# EasyEDA Pro project SplitUSB.epro

# Schematic Schematic1
Board Name: Board1; Create Date: 2026-05-01; Page Name: P1; Project Name: SplitUSB; Schematic Name: Schematic1; Update Date: 2026-05-01; Company: EasyEDA.com; Page Size: A4; Version: V1.0
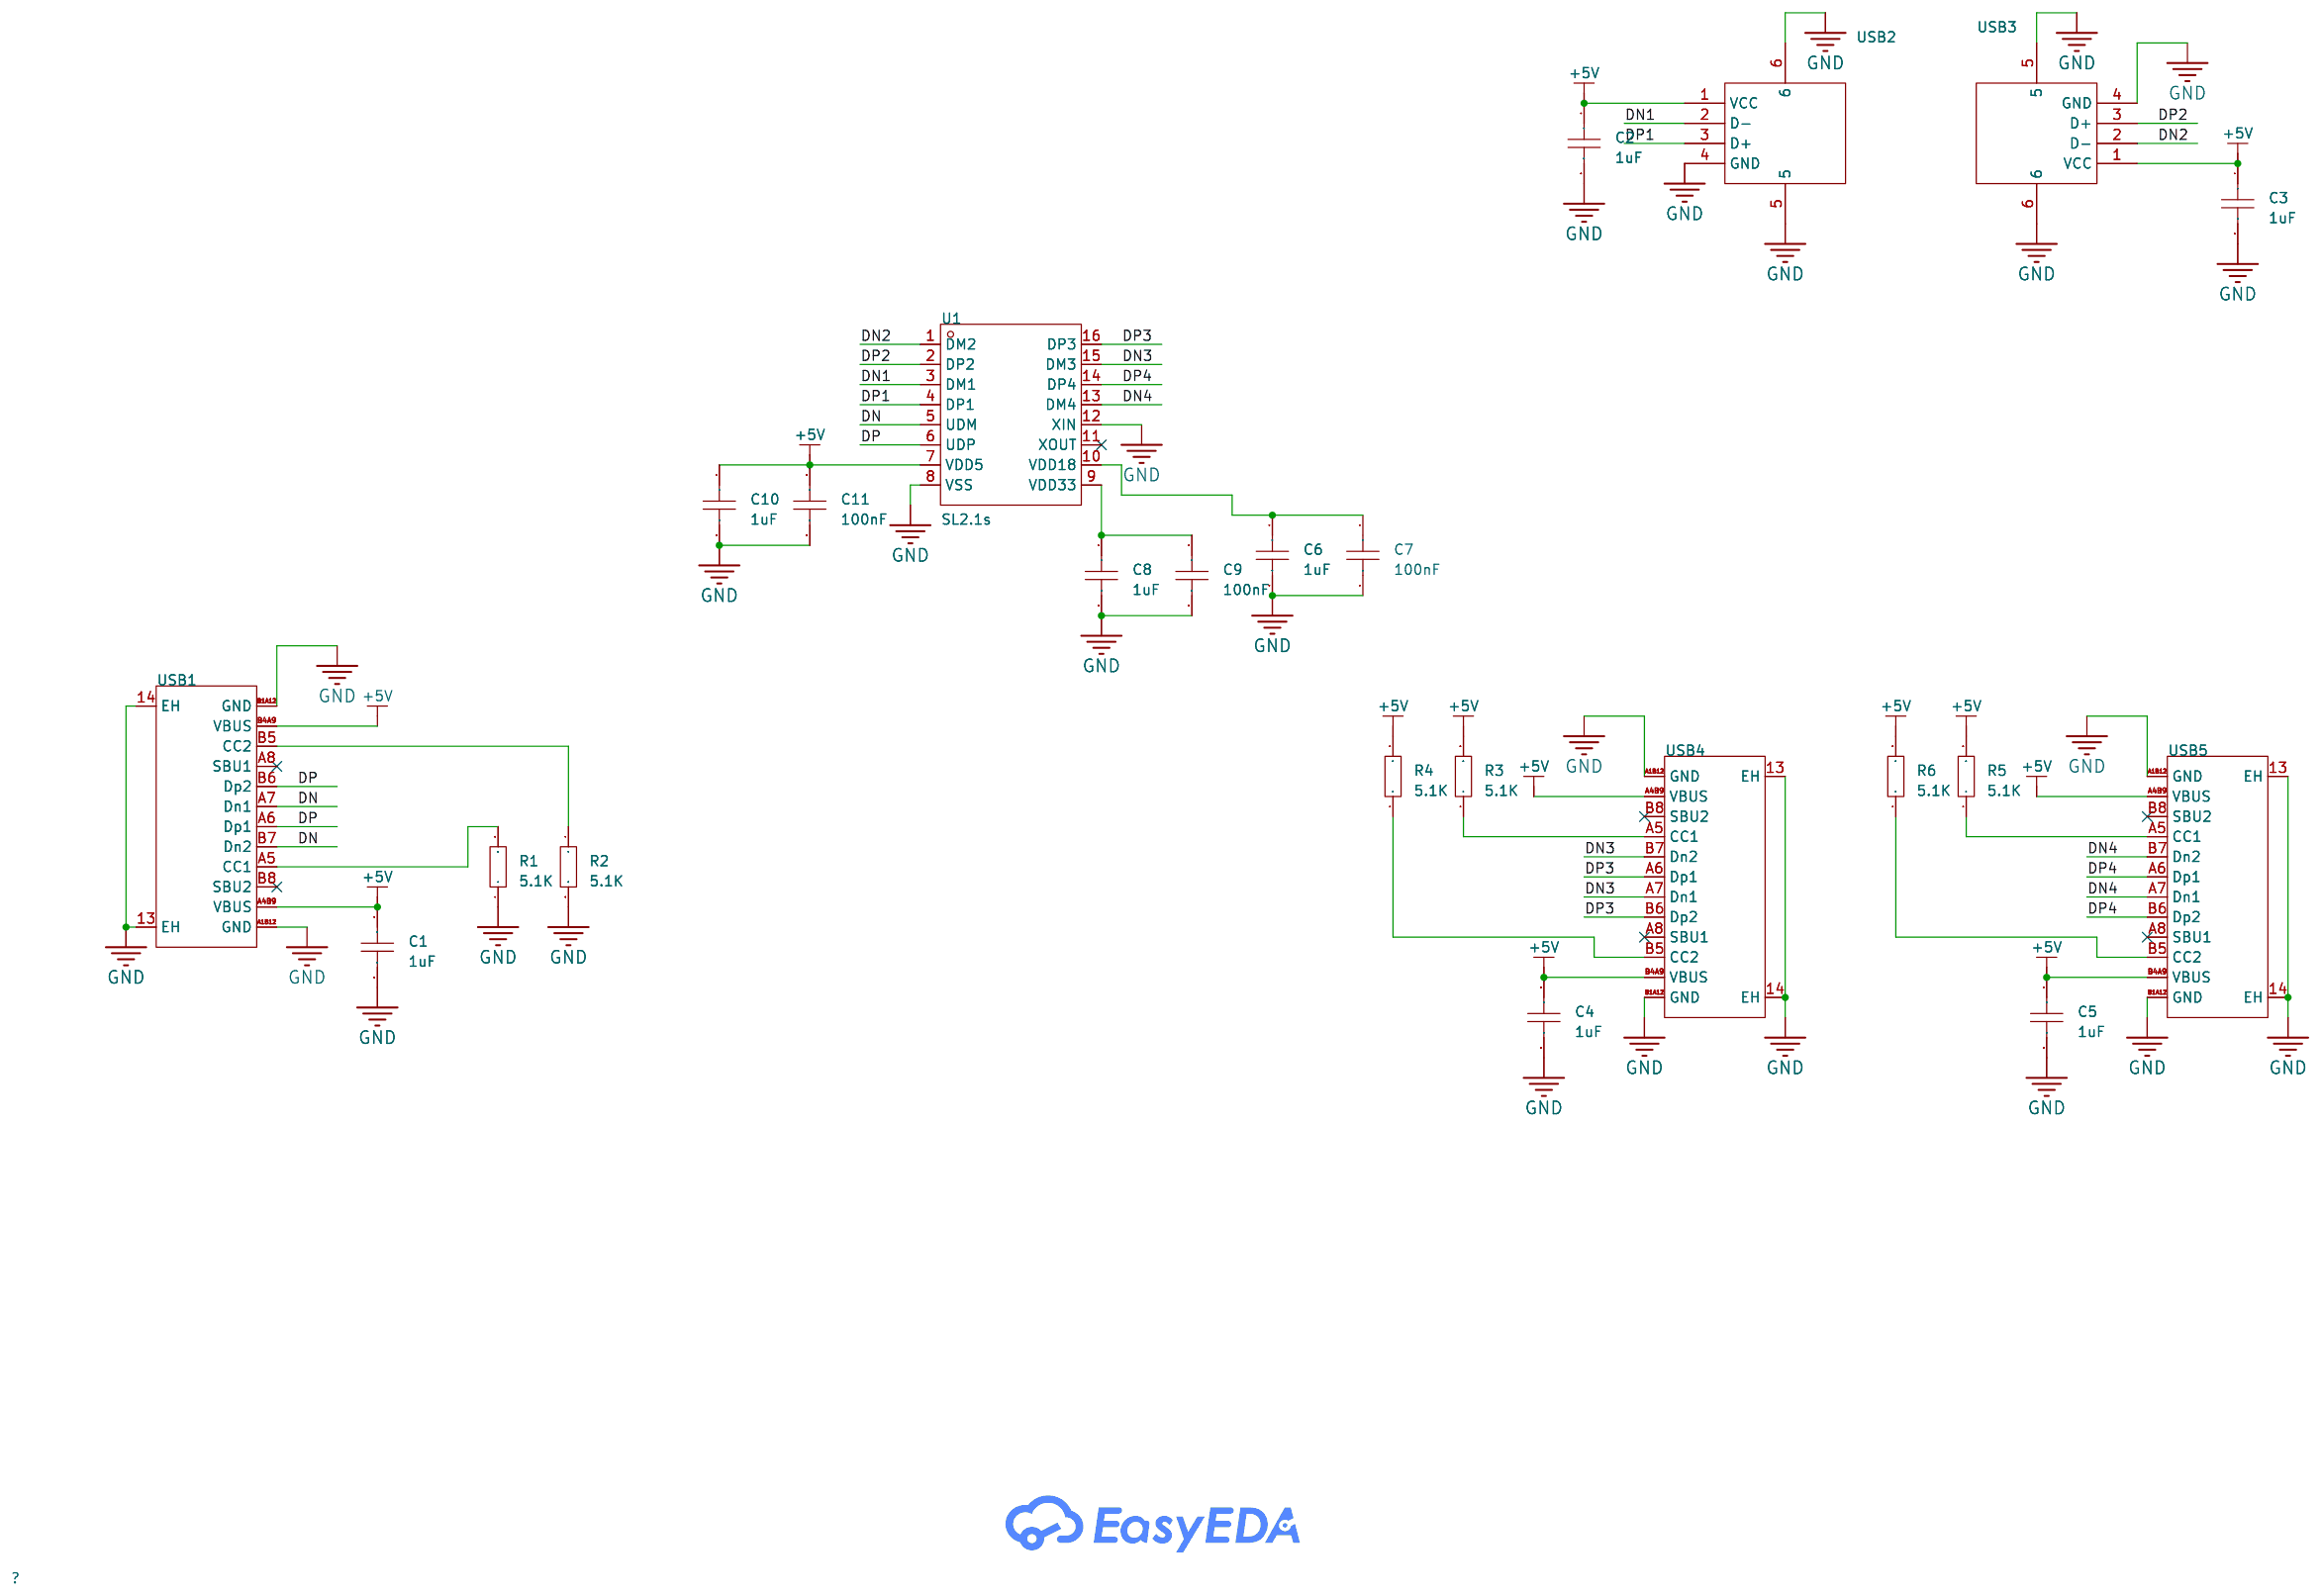
[diagram p0: schematic sheet]

## Parts
C1  1uF  [C0603]
C2  1uF  [C0603]
C3  1uF  [C0603]
C4  1uF  [C0603]
C5  1uF  [C0603]
C6  1uF  [C0603]
C7  100nF  [C0603]
C8  1uF  [C0603]
C9  100nF  [C0603]
C10  1uF  [C0603]
C11  100nF  [C0603]
R1  5.1K  [R0603]
R2  5.1K  [R0603]
R3  5.1K  [R0603]
R4  5.1K  [R0603]
R5  5.1K  [R0603]
R6  5.1K  [R0603]
U1  SL2.1s  [SSOP-16_L4.6-W2.6-P0.53-LS4.0-BL]
USB1  TYPE-C 16PIN 2MD(073)  [USB-C-SMD_TYPE-C-16PIN-2MD-073]
USB2  10.0 QHHTZB6.3  [USB-A-TH_10.0QHHTZB6.3]
USB3  10.0 QHHTZB6.3  [USB-A-TH_10.0QHHTZB6.3]
USB4  TYPE-C 16PIN 2MD(073)  [USB-C-SMD_TYPE-C-16PIN-2MD-073]
USB5  TYPE-C 16PIN 2MD(073)  [USB-C-SMD_TYPE-C-16PIN-2MD-073]

## Library data of the parts
C1-C11 = CAP_0603: Supplier Footprint: 0603
R1-R6 = Res_0603: Supplier Footprint: 0603
U1 = SL2.1s: type:Hub USB Protocol:USB 2.0 Data Rate:- Voltage - Supply:4V~5.25V Voltage - Supply:4V~5.25V Operating Temperature:0℃~+70℃ Operating Temperature:0℃~+70℃ Memory Interface:- Current - Supply:120mA Quiescent Supply Current:2.5mA Number of Channels:4; LCSC Part Name: USB2.0 HUB控制器集成电路; Supplier Part: C2684433; Manufacturer: CoreChips(和芯润德); Supplier Footprint: SSOP-16; JLCPCB Part Class: Extended Part; Datasheet: https://item.szlcsc.com/datasheet/SL2.1s/2782346.html; Supplier: LCSC; type: Hub; USB Protocol: USB 2.0; Voltage - Supply: 4V~5.25V; Operating Temperature: 0℃~+70℃; Current - Supply: 120mA; Quiescent Supply Current: 2.5mA; Number of Channels: 4
USB1 USB4 USB5 = TYPE-C 16PIN 2MD(073): Connector Type:Type-C Protocol Standard:- Gender:Female Mounting Type:Surface Mount, Right Angle Number of Contacts:16P Number of Ports:1 Current Rating-Power:3A Voltage Rating:5V Connect-Disconnect Life:10,000 Cycles Supplementary Features:- Center Heigh; LCSC Part Name: Type-C 母 卧贴; Supplier Part: C2765186; Manufacturer: SHOU HAN(首韩); Supplier Footprint: SMD; JLCPCB Part Class: Extended Part; Datasheet: https://item.szlcsc.com/datasheet/TYPE-C%252016PIN%25202MD(073)/2901843.html; Supplier: LCSC; Connector Type: Type-C; Gender: Female; Mounting Type: Surface Mount, Right Angle; Number of Contacts: 16P; Number of Ports: 1; Current Rating-Power: 3A; Voltage Rating: 5V; Connect-Disconnect Life: 10,000 Cycles; Detection color: Black; Operating Temperature: -25℃~+85℃
USB2 USB3 = 10.0 QHHTZB6.3: Connector Type:Type-A Protocol Standard:USB 2.0 Gender:Female Mounting Type:Surface Mount, Right Angle Number of Contacts:4P Number of Ports:1 Current Rating-Power:1.5A Voltage Rating:30V Connect-Disconnect Life:5,000 times Supplementary Features:- Center; LCSC Part Name: 壳长10.0mm; Supplier Part: C668591; Manufacturer: SHOU HAN(首韩); Supplier Footprint: SMD; JLCPCB Part Class: Extended Part; Datasheet: https://item.szlcsc.com/datasheet/10.0%2520QHHTZB6.3/698534.html; Supplier: LCSC; Connector Type: Type-A; Protocol Standard: USB 2.0; Gender: Female; Mounting Type: Surface Mount, Right Angle; Number of Contacts: 4P; Number of Ports: 1; Current Rating-Power: 1.5A; Voltage Rating: 30V; Connect-Disconnect Life: 5,000 times; Length: 10mm; Detection color: Black; Operating Temperature: -25℃~+85℃

## Nets
+5V: C1.1 C2.1 C3.1 C4.1 C5.1 C10.1 C11.1 R3.2 R4.2 R5.2 R6.2 U1.7(VDD5) USB1.A4B9(VBUS) USB1.B4A9(VBUS) USB2.1(VCC) USB3.1(VCC) USB4.A4B9(VBUS) USB4.B4A9(VBUS) USB5.A4B9(VBUS) USB5.B4A9(VBUS)
GND: C1.2 C2.2 C3.2 C4.2 C5.2 C6.2 C7.2 C8.2 C9.2 C10.2 C11.2 R1.1 R2.2 U1.8(VSS) U1.12(XIN) USB1.13(EH) USB1.14(EH) USB1.A1B12(GND) USB1.B1A12(GND) USB2.4(GND) USB2.5 USB2.6 USB3.4(GND) USB3.5 USB3.6 USB4.13(EH) USB4.14(EH) USB4.A1B12(GND) USB4.B1A12(GND) USB5.13(EH) USB5.14(EH) USB5.A1B12(GND) USB5.B1A12(GND)
DN: U1.5(UDM) USB1.A7(Dn1) USB1.B7(Dn2)
DN1: U1.3(DM1) USB2.2(D-)
DN2: U1.1(DM2) USB3.2(D-)
DN3: U1.15(DM3) USB4.A7(Dn1) USB4.B7(Dn2)
DN4: U1.13(DM4) USB5.A7(Dn1) USB5.B7(Dn2)
DP: U1.6(UDP) USB1.A6(Dp1) USB1.B6(Dp2)
DP1: U1.4(DP1) USB2.3(D+)
DP2: U1.2(DP2) USB3.3(D+)
DP3: U1.16(DP3) USB4.A6(Dp1) USB4.B6(Dp2)
DP4: U1.14(DP4) USB5.A6(Dp1) USB5.B6(Dp2)
$1N1280: R2.1 USB1.B5(CC2)
$1N1288: R1.2 USB1.A5(CC1)
$1N1972: R3.1 USB4.A5(CC1)
$1N1977: R4.1 USB4.B5(CC2)
$1N2527: C6.1 C7.1 U1.10(VDD18)
$1N2687: C8.1 C9.1 U1.9(VDD33)
$1N3745: R5.1 USB5.A5(CC1)
$1N3746: R6.1 USB5.B5(CC2)

Not connected (* = marked no-connect by the designer): U1 11(XOUT)*; USB1 A8(SBU1)* B8(SBU2)*; USB4 A8(SBU1)* B8(SBU2)*; USB5 A8(SBU1)* B8(SBU2)*

# Board PCB1
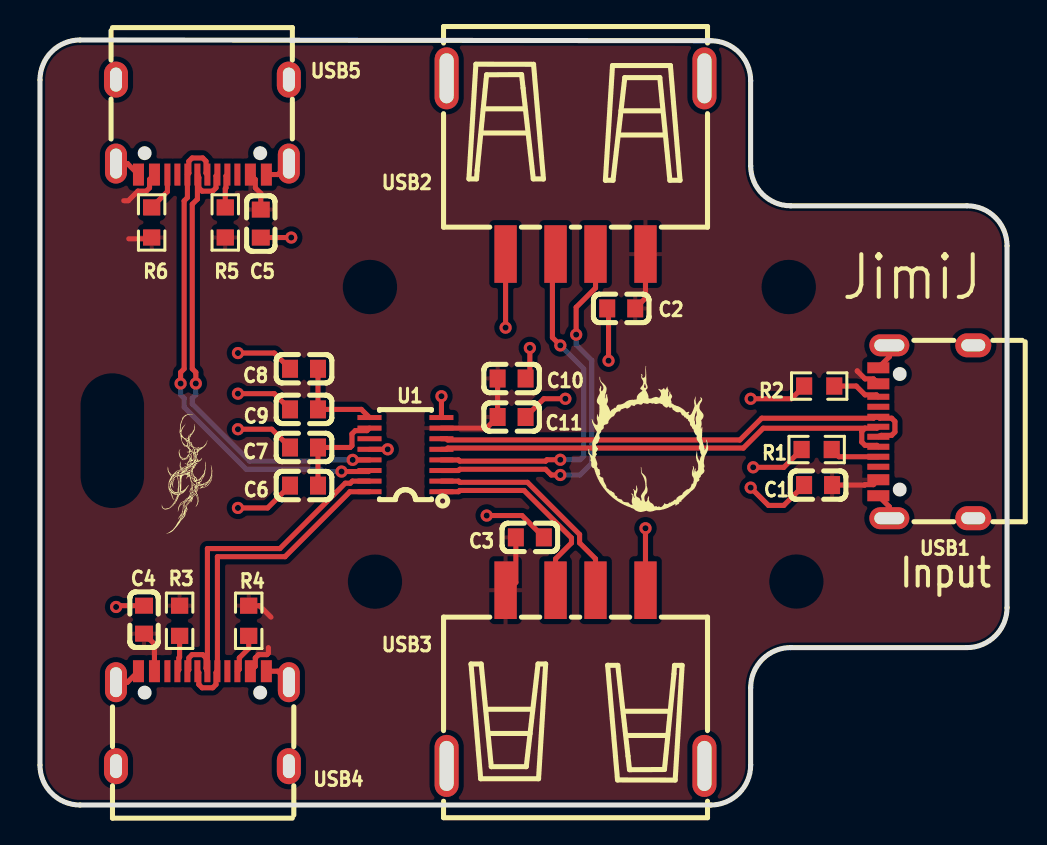
[diagram p1: board, top side]
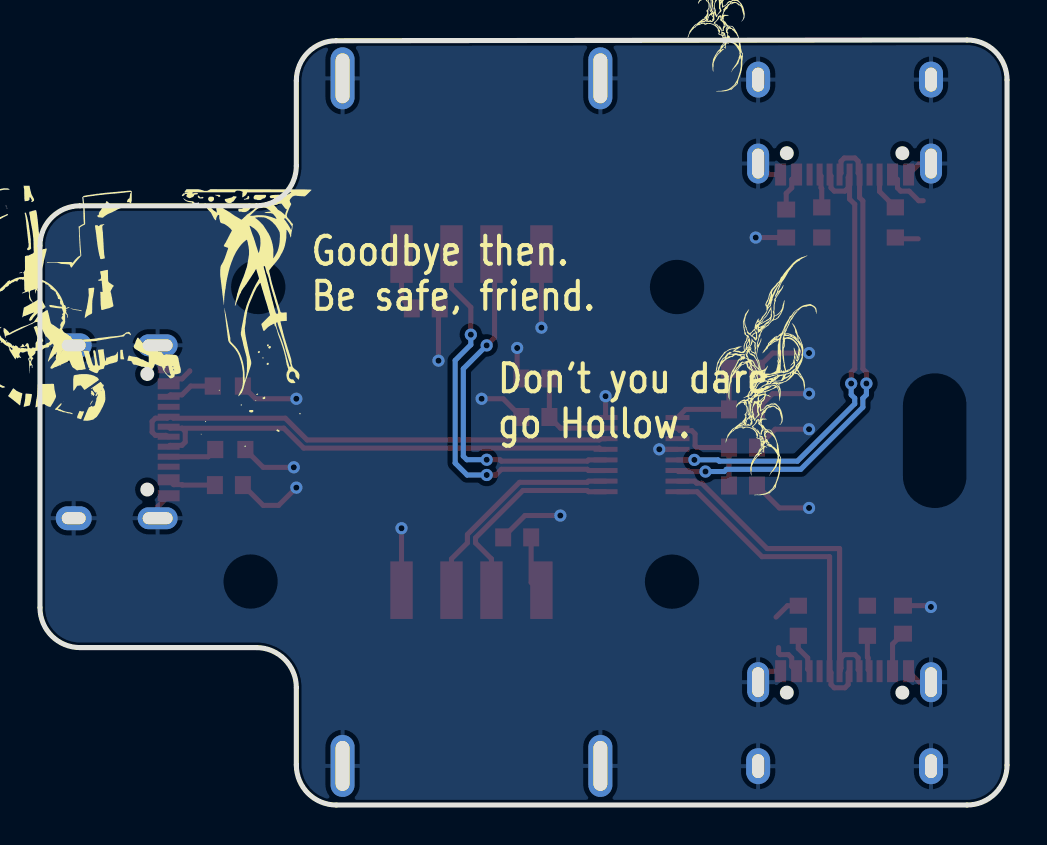
[diagram p2: board, bottom side, seen from below]

Outline 48.39 x 38.27 mm; copper layers: Top Layer, Bottom Layer. Coordinates in mm from the lower left corner of the outline.
Outline path: 0,36.27 arc(0.59,37.68) 2,38.27 33.56,38.23 arc(34.98,37.64) 35.56,36.23 35.56,31.97 arc(36.15,30.56) 37.56,29.97 46.39,29.97 arc(47.8,29.39) 48.39,27.97 48.39,9.87 arc(47.8,8.46) 46.39,7.87 37.56,7.87 arc(36.15,7.29) 35.56,5.87 35.56,2 arc(34.97,0.59) 33.56,0 2,0 arc(0.59,0.59) 0,2 0,36.27
Stack: Top Layer 0.035mm / Dielectric1 1.51mm FR4 er 4.5 / Bottom Layer 0.035mm

## Design rules (mm)
net DN2: DP4
net DP2: DP4
net DN1: DP5
net DP1: DP5
net DN: DP1
net DP: DP1
net DN4: DP2
net DP4: DP2
net DN3: DP3
net DP3: DP3
template: Custom Config
spacing copperThickness1oz (default): track to track 0.102, other pairs 0.152 to 0.3
spacing copperThickness2oz: track to track 0.203, other pairs 0.152 to 0.3
track width copperThickness1oz (default): min 0.127, default 0.254, max 2.54
track width copperThickness2oz: min 0.203, default 0.254, max 2.54
differential pair differentialPair (default): width min 0.127, default 0.254, max 2.54; gap min 0.152, default 0.152
via viaSize (default): diameter min 0.5, default 0.61, max 10; hole min 0.3, default 0.305, max 6.3

## Placement (name value [footprint] x y rotation side)
C1  1uF  [C0603]  38.93 16 180 top
C2  1uF  [C0603]  29.08 24.84 180 top
C3  1uF  [C0603]  24.51 13.39 0 top
C4  1uF  [C0603]  5.21 9.27 90 top
C5  1uF  [C0603]  11.05 29.08 270 top
C6  1uF  [C0603]  13.21 15.98 180 top
C7  100nF  [C0603]  13.21 17.88 180 top
C8  1uF  [C0603]  13.21 21.82 180 top
C9  100nF  [C0603]  13.21 19.79 180 top
C10  1uF  [C0603]  23.6 21.33 0 top
C11  100nF  [C0603]  23.6 19.41 0 top
R1  5.1K  [R0603]  38.86 17.78 0 top
R2  5.1K  [R0603]  38.99 20.95 180 top
R3  5.1K  [R0603]  6.99 9.22 90 top
R4  5.1K  [R0603]  10.44 9.22 90 top
R5  5.1K  [R0603]  9.27 29.14 270 top
R6  5.1K  [R0603]  5.59 29.14 270 top
U1  SL2.1s  [SSOP-16_L4.6-W2.6-P0.53-LS4.0-BL]  18.29 17.53 90 top
USB1  TYPE-C 16PIN 2MD(073)  [USB-C-SMD_TYPE-C-16PIN-2MD-073]  44.32 18.67 90 top
USB2  10.0 QHHTZB6.3  [USB-A-TH_10.0QHHTZB6.3]  26.8 31.95 180 top
USB3  10.0 QHHTZB6.3  [USB-A-TH_10.0QHHTZB6.3]  26.8 6.35 0 top
USB4  TYPE-C 16PIN 2MD(073)  [USB-C-SMD_TYPE-C-16PIN-2MD-073]  8.13 4.32 0 top
USB5  TYPE-C 16PIN 2MD(073)  [USB-C-SMD_TYPE-C-16PIN-2MD-073]  8.13 33.91 180 top

## Footprints (pads in the part's own frame, mm; a bottom-side part is the same pattern mirrored in y, then rotated)
C0603
  rect 0.8x0.9 smd: 1(-0.7,0) 2(0.7,0)
R0603
  rect 0.806x0.864 smd: 1(-0.753,0) 2(0.753,0)
SSOP-16_L4.6-W2.6-P0.53-LS4.0-BL
  rect 0.25x1.2 smd: 1(-1.855,-1.8) 2(-1.325,-1.8) 3(-0.795,-1.8) 4(-0.265,-1.8) 5(0.265,-1.8) 6(0.795,-1.8) 7(1.325,-1.8) 8(1.855,-1.8) 9(1.855,1.8) 10(1.325,1.8) 11(0.795,1.8) 12(0.265,1.8) 13(-0.265,1.8) 14(-0.795,1.8) 15(-1.325,1.8) 16(-1.855,1.8)
USB-A-TH_10.0QHHTZB6.3
  rect 1.12x2.88 smd: 1(-3.5,4.395) 2(-1,4.395) 3(1,4.395) 4(3.5,4.395)
  oval 1.2x3.1 hole 0.7x2.5: 5(-6.45,-4.395) 6(6.45,-4.395)
USB-C-SMD_TYPE-C-16PIN-2MD-073
  oval 1.1x2 hole 0.6x1.5: 13(-4.325,1.825) 14(4.325,1.825)
  oval 1.2x1.8 hole 0.6x1.2: 13(-4.325,-2.375) 14(4.325,-2.375)
  rect 0.55x1.1 smd: A1B12(-3.2,2.375) A4B9(-2.4,2.375) B1A12(3.2,2.375) B4A9(2.4,2.375)
  rect 0.3x1.1 smd: A5(-1.25,2.375) A6(-0.25,2.375) A7(0.25,2.375) A8(1.25,2.375) B5(1.75,2.375) B6(0.75,2.375) B7(-0.75,2.375) B8(-1.75,2.375)

## Nets
As in the schematic.

Pads without a net: U1 11; USB1 A8 B8; USB4 A8 B8; USB5 A8 B8

## Via types
v1: diameter 0.61, hole 0.305, Top Layer to Bottom Layer, 25 vias

## Routing (per net, layer and track width the routed paths; a pad name or vN(x,y) marks a point on that pad's centre or on a via; arc(x,y) is an arc through that point)
+5V: length 25.3
  Top Layer w0.254: R4.2 10.99,9.97 11.56,9.4 ; 23.3,10.62 23.81,11.13 C3.1 ; C10.1 C11.1 22.34,18.85 U1.7 ; USB1.B4A9 41.7,21.31 41.28,21.31 40.89,21.7 40.89,21.72 ; 11.43,7.87 11.43,7.59 11.36,7.52 10.94,7.52 10.77,7.36 10.77,6.94 USB4.B4A9 ; USB5.A4B9 10.77,31.29 10.77,30.87 11.05,30.59 C5.1 ; C2.1 30.3,25.35 USB2.1 ; 4.19,30.23 4.42,30.23 4.9,30.7 5.32,30.7 5.48,30.87 5.48,31.29 USB5.B4A9 ; C1.1 41.26,16 41.28,16.02 41.7,16.02 USB1.A4B9 ; 4.45,28.32 5.52,28.32 R6.2 ; USB4.A4B9 5.73,8.05 C4.1
GND: length 51
  Top Layer w0.254: v1(35.56,20.32) 37.6,20.32 R2.2 ; USB1.B1A12 42.5,22.42 USB1.14 ; v1(9.91,20.57) 11.73,20.57 C9.2 ; C10.2 24.51,21.55 v1(24.51,22.86) ; C8.2 11.73,22.61 v1(9.91,22.61) ; USB1.13 42.5,14.92 USB1.A1B12 ; USB5.14 4.38,32.08 USB5.B1A12 ; v1(35.56,15.88) 36.45,14.99 37.22,14.99 C1.2 ; USB5.A1B12 11.9,31.53 USB5.13 ; v1(22.35,14.48) 24.12,14.48 C3.2 ; C2.2 28.45,24.77 v1(28.45,22.22) ; USB4.14 11.9,6.69 USB4.B1A12 ; USB4.A1B12 4.38,6.14 USB4.13 ; v1(26.29,20.32) 25.21,20.32 C11.2 ; v1(3.81,9.91) 3.87,9.97 C4.2 ; C7.2 11.6,18.8 v1(9.91,18.8) ; C5.2 v1(12.57,28.38) ; v1(35.69,16.89) 37.22,16.89 R1.1 ; U1.12 v1(17.4,17.79) ; 30.3,10.62 v1(30.3,13.84) ; USB2.4 v1(23.3,23.88) ; v1(9.91,14.86) 11.39,14.86 C6.2 ; U1.8 v1(20.09,20.45)
DN: length 24
  Top Layer w0.254: 41.28,18.85 41.12,18.68 41.12,18.15 41.28,17.99 41.88,17.99 USB1.B7 ; 41.28,18.85 36.19,18.85 35.19,17.85 20.4,17.85 20.34,17.79 U1.5 ; 41.28,18.85 41.88,18.85 USB1.A7
DN1: length 19.1
  Top Layer w0.254: U1.3 20.94,16.73 21,16.79 25.3,16.79 25.58,16.51 v1(26.04,16.51) ; USB2.2 27.8,25.86 26.83,24.89 v1(26.83,23.53)
  Bottom Layer w0.254: v1(26.04,16.51) 27.02,16.51 27.61,17.1 27.61,22.24 26.83,23.02 v1(26.83,23.53)
DN2: length 10.6
  Top Layer w0.254: U1.1 20.94,15.67 21,15.73 24.22,15.73 26.59,13.36 26.59,13.11 25.8,12.31 25.8,10.62
DN3: length 18
  Top Layer w0.254: USB4.B7 7.45,6.76 7.45,7.36 7.61,7.52 8.14,7.52 8.31,7.36 8.31,6.84 8.36,6.79 8.36,6.72 USB4.A7 8.38,12.83 12,12.83 15.27,16.09 15.53,16.09 15.63,16.2 U1.15
DN4: length 24.2
  Top Layer w0.254: v1(7.8,21.08) 7.8,21.64 7.62,21.82 7.62,30.05 7.88,30.31 USB5.A7 7.9,31.51 7.9,31.44 7.95,31.39 7.95,30.87 8.11,30.7 8.64,30.7 8.81,30.87 8.81,31.46 USB5.B7 ; U1.13 15.65,17.26
  Bottom Layer w0.254: v1(7.8,21.08) 7.8,20.52 7.62,20.34 7.62,20.07 10.49,17.2 14.4,17.2 14.47,17.26 v1(15.64,17.26)
DP: length 24.7
  Top Layer w0.254: U1.6 20.34,18.32 20.4,18.26 35.02,18.26 36.11,19.35 41.71,19.35 41.78,19.42 USB1.B6 42.02,19.35 42.61,19.35 42.78,19.18 42.78,18.65 42.61,18.49 42.09,18.49 42.05,18.44 41.97,18.44 USB1.A6
DP1: length 18.1
  Top Layer w0.254: v1(26.04,22.99) 25.64,23.38 25.64,27.4 USB2.3 ; v1(26.04,17.27) 25.37,17.27 25.3,17.2 21,17.2 20.94,17.26 U1.4
  Bottom Layer w0.254: v1(26.04,17.27) 27.03,17.27 27.21,17.45 27.21,21.82 v1(26.04,22.99)
DP2: length 11.3
  Top Layer w0.254: U1.2 20.94,16.2 21,16.14 24.39,16.14 27,13.53 27,13.11 27.8,12.31 27.8,10.62
DP3: length 17.1
  Top Layer w0.254: U1.16 15.51,15.67 12.26,12.42 8.88,12.42 USB4.B6 8.81,6.62 8.81,6.03 8.64,5.86 8.11,5.86 7.95,6.03 7.95,6.62 USB4.A6
DP4: length 24.9
  Top Layer w0.254: v1(15.09,16.68) 16.44,16.68 U1.14 ; USB5.A6 8.31,31.6 8.31,32.2 8.14,32.36 7.61,32.36 7.45,32.2 7.45,31.6 USB5.B6 7.38,30.38 7.21,30.22 7.21,21.82 7.04,21.64 v1(7.04,21.08)
  Bottom Layer w0.254: v1(7.04,21.08) 7.04,20.52 7.21,20.34 7.21,19.9 10.32,16.79 14.03,16.79 14.15,16.68 v1(15.09,16.68)
$1N1280: length 2.4
  Top Layer w0.254: USB1.B5 41.85,20.52 41.28,20.52 40.84,20.95 R2.1
$1N1288: length 2.5
  Top Layer w0.254: USB1.A5 39.98,17.42 R1.2
$1N1972: length 1.8
  Top Layer w0.254: USB4.A5 6.95,6.76 6.95,7.36 6.99,7.4 6.99,8.46
$1N1977: length 2
  Top Layer w0.254: USB4.B5 9.97,6.79 9.97,7.36 10.44,7.83 10.44,8.46
$1N2527: length 5.2
  Top Layer w0.254: C6.1 C7.1 15.52,17.88 15.61,17.97 15.61,18.56 15.77,18.72 16.36,18.72 U1.10
$1N2687: length 4.8
  Top Layer w0.254: C8.1 C9.1 16.08,19.79 U1.9
$1N3745: length 1.7
  Top Layer w0.254: R5.1 9.27,30.83 9.31,30.87 9.31,31.46 USB5.A5
$1N3746: length 2
  Top Layer w0.254: USB5.B5 6.38,30.68 R6.1

## Copper pours and planes (outline as drawn; the poured copper is in the pictures)
+5V on Top Layer: -5.97,41.53 53.59,41.53 53.59,-4.57 -5.97,-4.57
GND on Bottom Layer: -7.62,47.62 54.36,47.62 54.36,-6.1 -7.62,-6.1

## Text on the board
Bottom Silkscreen Layer: Don't you dare / go Hollow. | Goodbye then. / Be safe, friend.
Top Silkscreen Layer: Input | JimiJ
